# Altium schematic sheet driver y convertidor.SchDoc
size A3
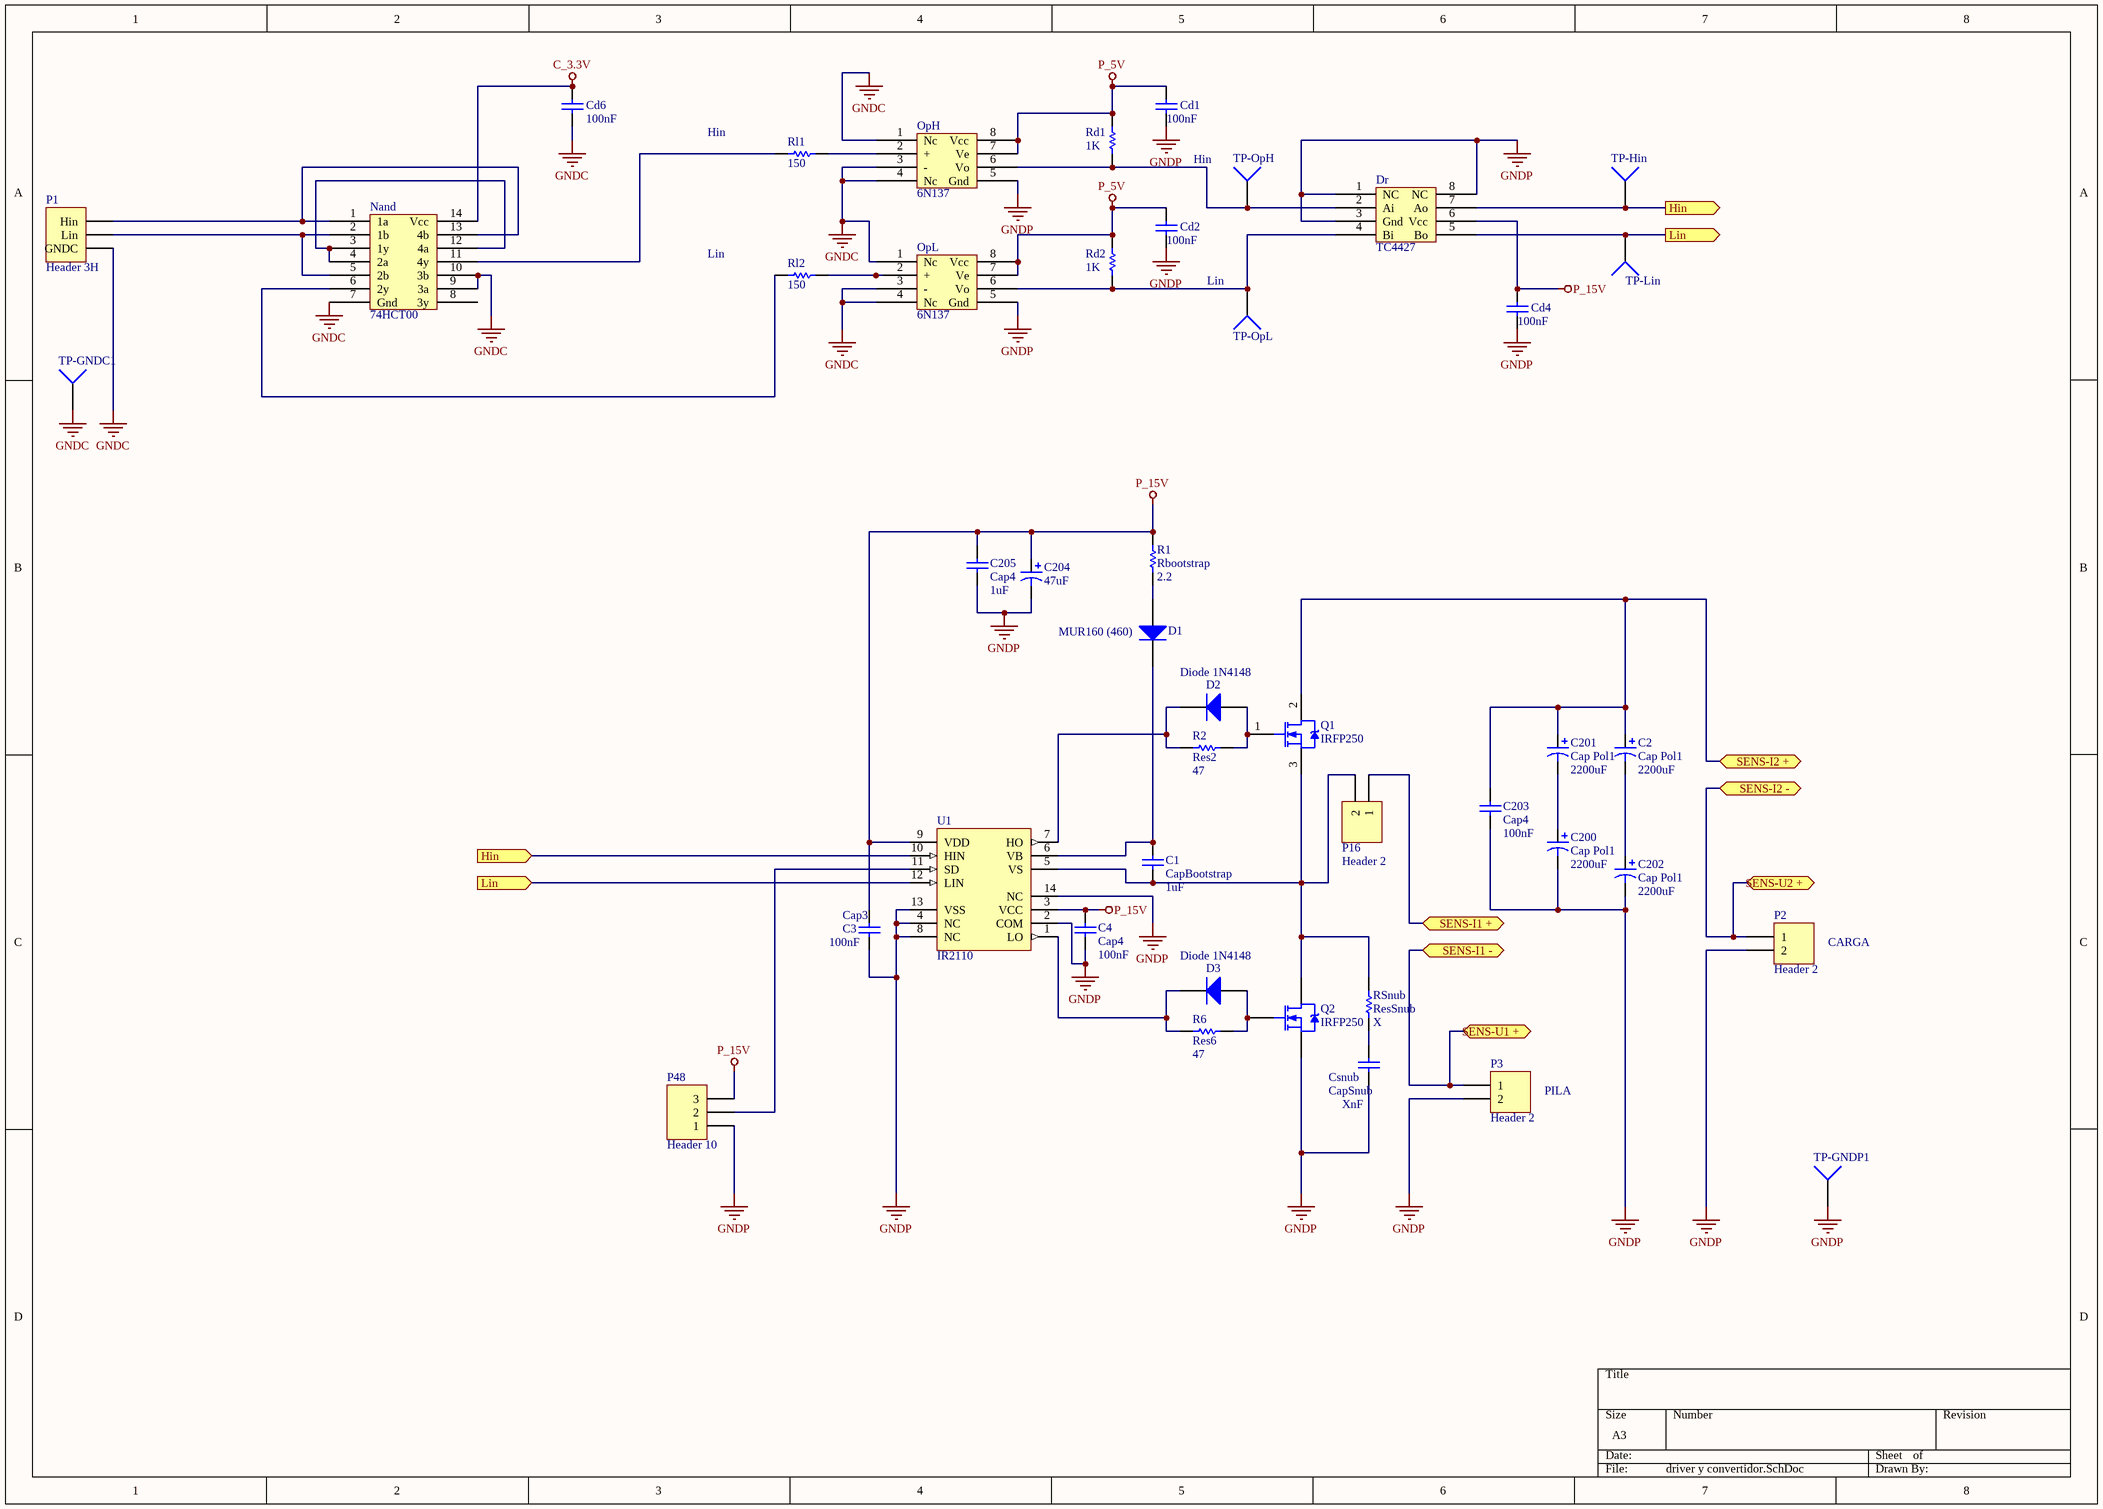
[diagram p0: driver y convertidor.SchDoc]

## Parts
C1  CapBootstrap  value 1uF  [RAD-0.1]
C2  Cap Pol1  value 2200uF  [RB12.7-25*]
C3  Cap3  value 100nF  [8-1206]
C4  Cap4  value 100nF  [8-1206]
C200  Cap Pol1  value 2200uF  [RB12.7-25*]
C201  Cap Pol1  value 2200uF  [RB12.7-25*]
C202  Cap Pol1  value 2200uF  [RB12.7-25*]
C203  Cap4  value 100nF  [8-1206]
C204  value 47uF  [RB5.8-6.4*]  (hidden comment: Cap Pol1)
C205  Cap4  value 1uF  [8-1206]
Cd1  value 100nF  [8-1206]  (hidden comment: Capd1)
Cd2  value 100nF  [8-1206]  (hidden comment: Capd2)
Cd4  value 100nF  [8-1206]  (hidden comment: Capd2)
Cd6  value 100nF  [8-1206]  (hidden comment: Capd2)
Csnub  CapSnub  value XnF  [FootSnub]
D1  MUR160 (460)  [CASE 267*]
D2  Diode 1N4148  [DO-35]
D3  Diode 1N4148  [DO-35]
Dr  TC4427  [TC4424-DIP8]
Nand  74HCT00  [MM74HC00_GON]
OpH  6N137  [6n137]
OpL  6N137  [6n137]
P1  Header 3H  [HDR1X3H*]
P2  Header 2  [HDR1X2-POT*]
P3  Header 2  [Ind-Conector]
P16  Header 2  [Ind-Conector]
P48  Header 10  [HDR1X3*]
Q1  IRFP250  [TO-247AC]
Q2  IRFP250  [TO-247AC]
R1  Rbootstrap  value 2.2  [8-1206]
R2  Res2  value 47  [8-1206]
R6  Res6  value 47  [8-1206]
Rd1  value 1K  [8-1206]  (hidden comment: Rd1)
Rd2  value 1K  [8-1206]  (hidden comment: Rd2)
Rl1  value 150  [8-1206]  (hidden comment: Rd1)
Rl2  value 150  [8-1206]  (hidden comment: Rd1)
RSnub  ResSnub  value X  [FootSnub]
TP-GNDC1  (no value)  [PIN1]
TP-GNDP1  (no value)  [PIN1]
TP-Hin  (no value)  [PIN1]
TP-Lin  (no value)  [PIN1]
TP-OpH  (no value)  [PIN1]
TP-OpL  (no value)  [PIN1]
U1  IR2110  [PDIP14]

## Ports
Hin (in), Hin (out), Lin (in), Lin (out), SENS-I1 + (bidir), SENS-I1 - (bidir), SENS-I2 + (bidir), SENS-I2 - (bidir), SENS-U1 + (bidir), SENS-U2 + (bidir)

## Nets
C_3.3V: Cd6.1 Nand.14(Vcc)
GNDC: Cd6.2 Nand.7(Gnd) Nand.9(3a) Nand.10(3b) OpH.1(Nc) OpH.3(-) OpH.4(Nc) OpL.1(Nc) OpL.3(-) OpL.4(Nc) P1.1(GNDC) TP-GNDC1.1
GNDP: C3.2 C4.2 C200.2 C202.2 C203.2 C204.2 C205.2 Cd1.2 Cd2.2 Cd4.2 Csnub.2 Dr.1(NC) Dr.3(Gnd) Dr.8(NC) OpH.5(Gnd) OpL.5(Gnd) P2.2 P3.2 P48.1 Q2.3(S) TP-GNDP1.1 U1.2(COM) U1.4(NC) U1.8(NC) U1.13(VSS) U1.14(NC)
P_5V: Cd1.1 Cd2.1 OpH.7(Ve) OpH.8(Vcc) OpL.7(Ve) OpL.8(Vcc) Rd1.1 Rd2.1
P_15V: C3.1 C4.1 C204.1 C205.1 Cd4.1 Dr.6(Vcc) P48.3 R1.1 U1.3(VCC) U1.9(VDD)
Hin: Dr.7(Ao) TP-Hin.1 U1.10(HIN) ; port Hin
Lin: Dr.5(Bo) TP-Lin.1 U1.12(LIN) ; port Lin
SENS-I1 +: P16.1 ; port SENS-I1 +
SENS-I1 -: P3.1 ; port SENS-I1 -, port SENS-U1 +
SENS-I2 +: C2.1 C201.1 C203.1 Q1.2(D) ; port SENS-I2 +
SENS-I2 -: P2.1 ; port SENS-I2 -, port SENS-U2 +
NetC1_1: C1.1 D1.2(K) U1.6(VB)
NetC1_2: C1.2 P16.2 Q1.3(S) Q2.2(D) RSnub.2 U1.5(VS)
NetC2_2: C2.2 C202.1
NetC200_1: C200.1 C201.2
NetCsnub_1: Csnub.1 RSnub.1
NetD1_1: D1.1(A) R1.2
NetD2_1: D2.1(A) Q1.1(G) R2.2
NetD2_2: D2.2(K) R2.1 U1.7(HO)
NetD3_1: D3.1(A) Q2.1(G) R6.2
NetD3_2: D3.2(K) R6.1 U1.1(LO)
NetDr_2: Dr.2(Ai) OpH.6(Vo) Rd1.2 TP-OpH.1
NetDr_4: Dr.4(Bi) OpL.6(Vo) Rd2.2 TP-OpL.1
NetNand_1: Nand.1(1a) Nand.13(4b) P1.3(Hin)
NetNand_2: Nand.2(1b) Nand.5(2b) P1.2(Lin)
NetNand_3: Nand.3(1y) Nand.4(2a) Nand.12(4a)
NetNand_6: Nand.6(2y) Rl2.1
NetNand_11: Nand.11(4y) Rl1.1
NetOpH_2: OpH.2(+) Rl1.2
NetOpL_2: OpL.2(+) Rl2.2
NetP48_2: P48.2 U1.11(SD)

Not connected (* = marked no-connect by the designer): Nand 8(3y)

## Notes on the sheet
- Hin
- Lin
- (near TP-OpL) Lin
- CARGA
- PILA

## Library data of the parts
C1 = Cap: THRU MULTICAPA 50V; Published: 8-Jun-2000; LatestRevisionDate: 17-Jul-2002; LatestRevisionNote: Re-released for DXP Platform.; PackageReference: RAD-0.3; Publisher: Altium Limited; PackageDescription: Radial Cap, Thru-Hole; 2 Leads; 0.3 in Pin Spacing
C2 C200-C202 C204 = Cap Pol1: Polarized Capacitor (Radial); Published: 8-Jun-2000; LatestRevisionDate: 17-Jul-2002; LatestRevisionNote: Re-released for DXP Platform.; PackageReference: RB7.6-15; Publisher: Altium Limited
C3 C4 C203 C205 Cd1 Cd2 Cd4 Cd6 Csnub = Cap: SMD MULTICAPA 50V; Published: 8-Jun-2000; LatestRevisionDate: 17-Jul-2002; LatestRevisionNote: Re-released for DXP Platform.; PackageReference: RAD-0.3; Publisher: Altium Limited; PackageDescription: Radial Cap, Thru-Hole; 2 Leads; 0.3 in Pin Spacing
D1 = Diode 1N4007: THRU; Published: 8-Jun-2000; LatestRevisionDate: 17-Jul-2002; LatestRevisionNote: Re-released for DXP Platform.; DatasheetVersion: 1998; PackageVersion: Aug-1999; PackageReference: DO-41; Publisher: Altium Limited; PackageDescription: Diode, Axial; Body 5.2 x 2.7 mm (LxDia. max), Lead Dia. 0.86 mm (max); Code_JEDEC: DO-204-AL; ComponentLink1Description: Manufacturer Link; ComponentLink1URL: http://www.fairchildsemi.com/; ComponentLink2Description: Datasheet; ComponentLink2URL: http://www.fairchildsemi.com/ds/1N%2F1N4001.pdf
D2 D3 = Diode 1N4148: THRU; Published: 8-Jun-2000; LatestRevisionDate: 17-Jul-2002; LatestRevisionNote: Re-released for DXP Platform.; DatasheetVersion: 1997; PackageReference: DO-35; Publisher: Altium Limited; PackageDescription: Diode, Axial; Body 3.8 x 1.9 mm (LxDia. max), Lead Dia. 0.53 mm (max); Code_JEDEC: DO-204-AH; ComponentLink1Description: Manufacturer Link; ComponentLink1URL: http://www.fairchildsemi.com/; ComponentLink2Description: Datasheet; ComponentLink2URL: http://www.fairchildsemi.com/ds/1N%2F1N4148.pdf
P1 = Header 3H: Header, 3-Pin, Right Angle; LatestRevisionDate: 17-Jul-2002; LatestRevisionNote: Re-released for DXP Platform.; Publisher: Altium Limited
P2 P3 P16 = Header 2: Header, 2-Pin; LatestRevisionDate: 17-Jul-2002; LatestRevisionNote: Re-released for DXP Platform.; Publisher: Altium Limited
P48 = Header 3: Header, 3-Pin; LatestRevisionDate: 17-Jul-2002; LatestRevisionNote: Re-released for DXP Platform.; Publisher: Altium Limited
Q1 Q2 = IRFP250: HEXFET Power MOSFET; Note: Pin 2 is electrically connected to the Heatsink (4).; Published: 8-Jun-2000; LatestRevisionDate: 17-Jul-2002; LatestRevisionNote: Re-released for DXP Platform.; DatasheetVersion: PD-9.443D; PackageVersion: Aug-1997; PackageReference: TO-247AC; Publisher: Altium Limited; PackageDescription: SIP with Mounting Hole; 3 Leads; Body 20 x 15.6 x 5 mm (typ); Pitch 5.45 mm; Code_JEDEC: TO-247-AC; ComponentLink1Description: Manufacturer Link; ComponentLink1URL: http://www.irf.com/; ComponentLink2Description: Datasheet; ComponentLink2URL: http://www.irf.com/product-info/datasheets/data/irfp250.pdf
R1 R2 R6 Rd1 Rd2 Rl1 Rl2 RSnub = Res1: SMD 1206; Published: 8-Jun-2000; LatestRevisionDate: 17-Jul-2002; LatestRevisionNote: Re-released for DXP Platform.; PackageReference: AXIAL-0.3; Publisher: Altium Limited; PackageDescription: Axial Device, Thru-Hole; 2 Leads; 0.3 in Pin Spacing
TP-GNDC1 TP-GNDP1 TP-Hin TP-Lin TP-OpH TP-OpL = Socket: LatestRevisionDate: 17-Jul-2002; LatestRevisionNote: Re-released for DXP Platform.; Publisher: Altium Limited
U1 = IR2110: High and Low Side Driver; Note: Pins 4, 8 and 14 are not connected; Published: 8-Jun-2000; LatestRevisionDate: 04-Mar-2005; LatestRevisionNote: Stylized 3D Model Added.; DatasheetVersion: PD60147J; PackageReference: PDIP14; Publisher: Altium Limited; PackageDescription: DIP; 14 Leads; Row Spacing 7.62 mm; Pitch 2.54 mm; ComponentLink1Description: Manufacturer Link; ComponentLink1URL: http://www.irf.com/; ComponentLink2Description: Datasheet; ComponentLink2URL: http://www.irf.com/product-info/datasheets/data/ir2110.pdf